# Altium project JUMPER_CH340B.PrjPcb
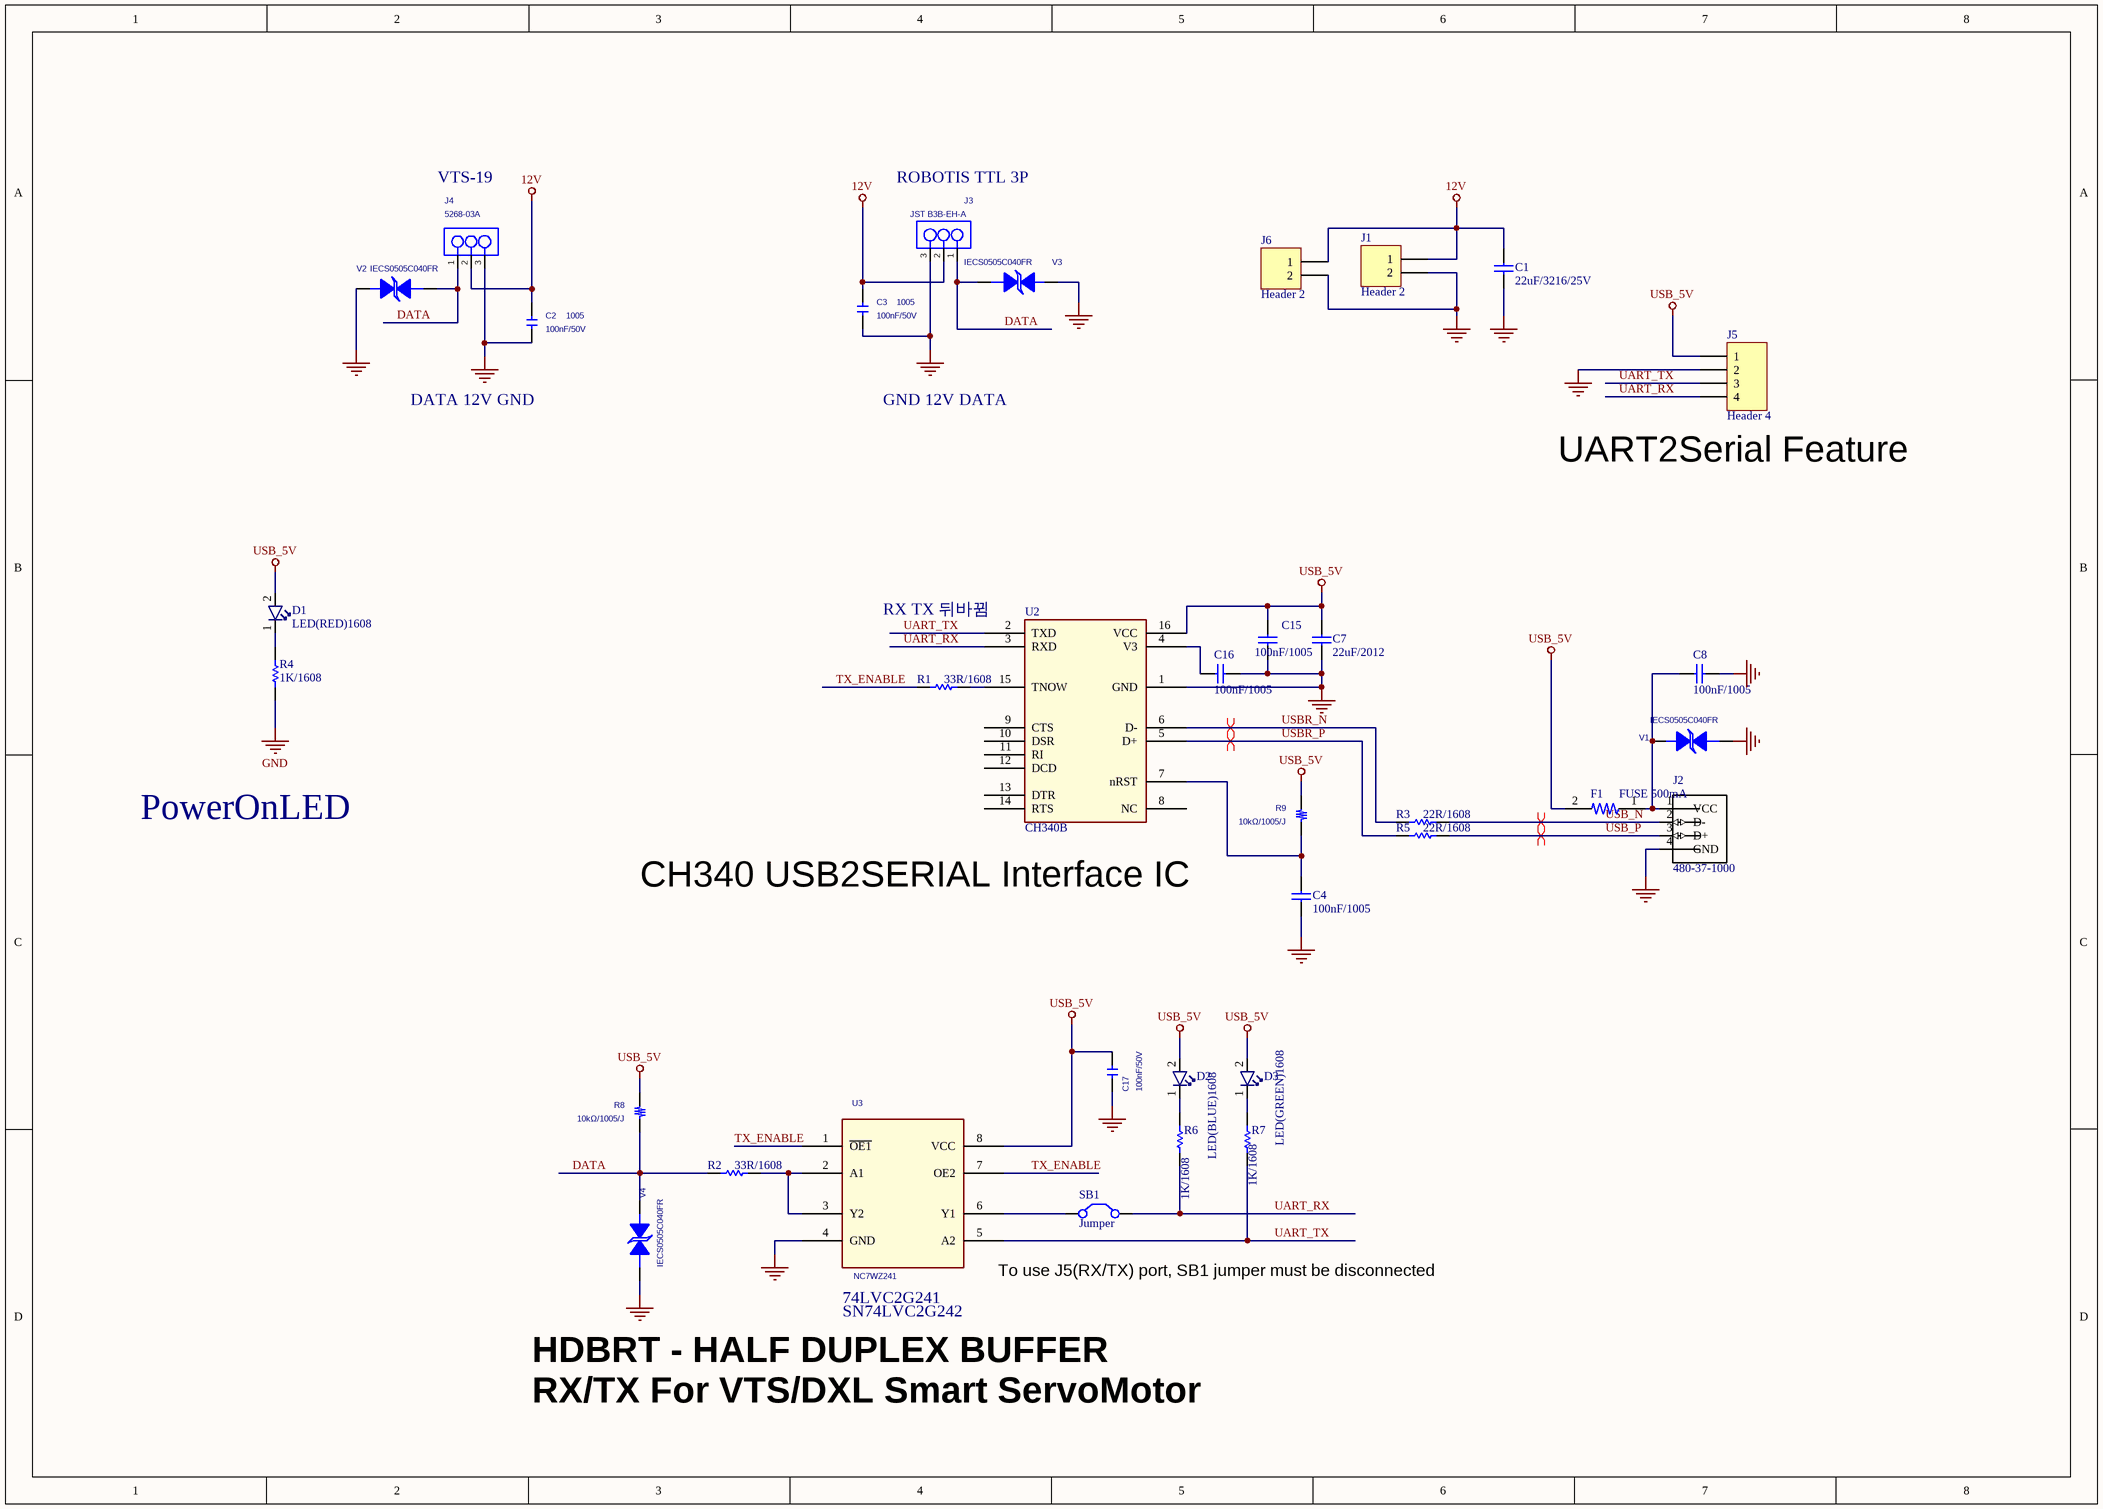
[diagram p0: 01_JUMPER.SchDoc]
=Author: Simon
1 sheet, 35 parts. Net scope: global (net labels, ports and power ports of the same name join across sheets).
Board file: CH340B_JUMPER.PcbDoc

## Sheet 01_JUMPER.SchDoc: CH340 Demo Board
size A3; Author: MegaParts; DrawnBy: Sangmin; Engineer: Simon; Organization: megaparts; Revision: B; SheetNumber: 1; SheetTotal: 1

### Parts
C1  22uF/3216/25V  [C3216-LJS]
C2  value 100nF/50V  size: 1005  [CAPC1608X06L]  (hidden comment: CAP-CHIP-1005)
C3  value 100nF/50V  size: 1005  [CAPC1608X06L]  (hidden comment: CAP-CHIP-1005)
C4  100nF/1005  [CAPC1608X06L]
C7  22uF/2012  [CAPC2012X00L]
C8  100nF/1005  [CAPC1608X06L]
C15  100nF/1005  [CAPC1608X06L]
C16  100nF/1005  [CAPC1608X06L]
C17  value 100nF/50V  [CAPC1608X06L]  (hidden comment: CAP-CHIP-1005)
D1  LED(RED)1608  [LED_0603_G]
D2  LED(BLUE)1608  [LED_0603_G]
D3  LED(GREEN)1608  [LED_0603_G]
F1  FUSE 500mA  [FUSE1812]
J1  Header 2  [HDR1X2]
J2  480-37-1000  [MOLEX_480-37-1000]
J3  JST B3B-EH-A  [JST_B3B-EH-A]
J4  5268-03A  [5267-03]
J5  Header 4  [5267-04A-2.5P]
J6  Header 2  [BLOCK-5.08MMX2P_NO_SILK]
R1  33R/1608  [RESC1608X06L]
R2  33R/1608  [RESC1608X06L]
R3  22R/1608  [RESC1608X06L]
R4  1K/1608  [RESC1608X06L]
R5  22R/1608  [RESC1608X06L]
R6  1K/1608  [RESC1608X06L]
R7  1K/1608  [RESC1608X06L]
R8  value 10kΩ/1005/J  [RESC1608X06L]  (hidden comment: RES-CHIP-1005)
R9  value 10kΩ/1005/J  [RESC1608X06L]  (hidden comment: RES-CHIP-1005)
SB1  Jumper  [Solderbridge_Shorted]
U2  CH340B  [SOIC16P-50MIL]
U3  NC7WZ241  [MO-187_0.5_2.0X3.1]
V1  IECS0505C040FR  [RESC1608X06L]
V2  IECS0505C040FR  [RESC1608X06L]
V3  IECS0505C040FR  [RESC1608X06L]
V4  IECS0505C040FR  [RESC1608X06L]

### Nets
12V: C1.1 C2.2 C3.2 J1.1 J3.2 J4.2 J6.1
GND: C1.2 C2.1 C3.1 C4.1 C7.2 C8.2 C15.2 C16.2 C17.1 J1.2 J2.4(GND) J3.3 J4.3 J5.2 J6.2 R4.1 U2.1(GND) U3.4(GND) V1.1(ANODE) V2.2(CATHODE) V3.2(CATHODE) V4.1(ANODE)
USB_5V: C7.1 C15.1 C17.2 D1.2(A) D2.2(A) D3.2(A) F1.2 J5.1 R8.2 R9.2 U2.16(VCC) U3.8(VCC)
DATA: J3.1 J4.1 R2.2 R8.1 V2.1(ANODE) V3.1(ANODE) V4.2(CATHODE)
TX_ENABLE: R1.2 U3.1(~{OE1}) U3.7(OE2)
UART_RX: J5.4 R6.1 SB1.2(C2) U2.3(RXD)
UART_TX: J5.3 R7.1 U2.2(TXD) U3.5(A2)
USB_N: J2.2(D-) R3.1
USB_P: J2.3(D+) R5.1
USBR_N: R3.2 U2.6(D-)
USBR_P: R5.2 U2.5(D+)
NetC4_2: C4.2 R9.1 U2.7(nRST)
NetC8_1: C8.1 F1.1 J2.1(VCC) V1.2(CATHODE)
NetC16_1: C16.1 U2.4(V3)
NetD1_1: D1.1(C) R4.2
NetD2_1: D2.1(C) R6.2
NetD3_1: D3.1(C) R7.2
NetR1_1: R1.1 U2.15(TNOW)
NetR2_1: R2.1 U3.2(A1) U3.3(Y2)
NetSB1_1: SB1.1(C1) U3.6(Y1)

Not connected (* = marked no-connect by the designer): U2 8(NC) 9(CTS) 10(DSR) 11(RI) 12(DCD) 13(DTR) 14(RTS)

### Layout directives
differential pair: USB_N, USB_P, USBR_N, USBR_P

### Notes on the sheet
- VTS-19
- ROBOTIS TTL 3P
- DATA 12V GND
- GND 12V DATA
- (near J5) UART2Serial Feature
- RX TX 뒤바뀜
- PowerOnLED
- (near U2) CH340 USB2SERIAL Interface IC
- (near U3) 74LVC2G241
- SN74LVC2G242
- To use J5(RX/TX) port, SB1 jumper must be disconnected
- HDBRT - HALF DUPLEX BUFFER
  RX/TX For VTS/DXL Smart ServoMotor

### Library data of the parts
C1 C4 C7 C8 C15 C16 = CAP_0402: Capacitor, NP0, ±0.1pF
  C1: Value: 22uF/3216/25V
  C4 C8 C15 C16: Value: 100nF/1005
  C7: Value: 22uF/2012
C17 = CAP-CHIP-1005: PCB DECAL: 1005; size: 1005
D1-D3 = D:LED: LED SMARTLED GREEN 570NM 0603
  D1: Value: LED(RED)1608
  D2: Value: LED(BLUE)1608
  D3: Value: LED(GREEN)1608
F1 = 0ZCJ0050AF2E: 1206 SMT PPTC | 0.50 Ih | 24V; Value: FUSE/3216/5V/500mA; MF: Bel Fuse; Availability: Unavailable; Price: None; Package: 1206 Bel Fuse; MP: 0ZCJ0050AF2E; SnapEDA_Link: https://www.snapeda.com/parts/0ZCJ0050AF2E/Bel%20Fuse%20Inc./view-part/1301170/?ref=snap
J1 J6 = Header 2: Header, 2-Pin; LatestRevisionDate: 17-Jul-2002; LatestRevisionNote: Re-released for DXP Platform.; Publisher: Altium Limited
J2 = 480-37-1000: USB-A _USB TYPE-A_ USB 2.0 Plug Connector 4 Position Surface Mount, Right Angle; Through Hole; MP: 48037-1000; MF: Molex; Price: None; SnapEDA_Link: https://www.snapeda.com/parts/48037-1000/Molex/view-part/431726/?ref=snap; Package: None; Availability: Unavailable; Value: *
J3 = 5268-03A: Value: JST B3B-EH-A
J5 = Header 4: Header, 4-Pin; LatestRevisionDate: 17-Jul-2002; LatestRevisionNote: Re-released for DXP Platform.; Publisher: Altium Limited
R1-R7 = RES_0603: Not mounted
  R1 R2: Value: 33R/1608
  R3 R5: Value: 22R/1608
  R4 R6 R7: Value: 1K/1608
R8 R9 = RES-CHIP-1005: PCB DECAL: 1005; size: 1005
SB1 = Jumper: Jumper Wire; Published: 24-Mar-1999; LatestRevisionDate: 17-Jul-2002; LatestRevisionNote: Re-released for DXP Platform.; PackageReference: RAD-0.2; Publisher: Altium Limited; PackageDescription: Radial Cap, Thru-Hole; 2 Leads; 0.2 in Pin Spacing
V1-V4 = DIODE TVS_1
C2 C3 = CAP-CHIP-1005: PCB DECAL: 1005
J4 = 5268-03A: Value: 5268-03A
U3 = NC7WZ241: Value: NC7WZ241